# EAGLE design E_LELE (EAGLE 9.5.1)
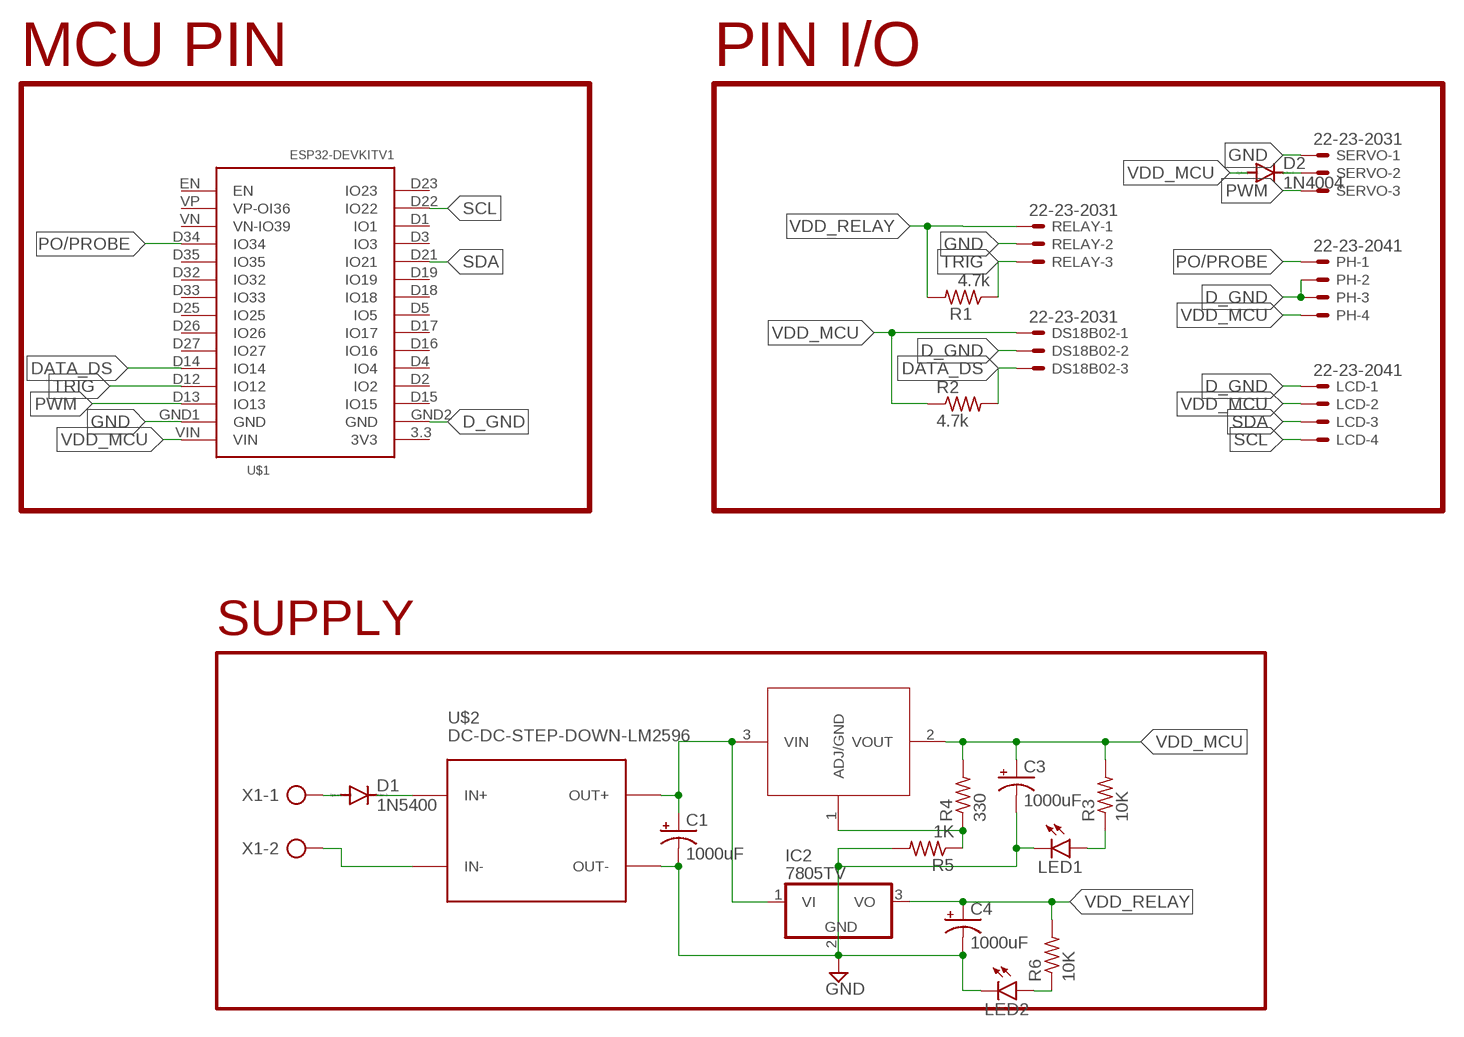
[diagram p0: schematic, sheet 1]

## Parts
C1  1000uF  CPOL-USE5-10.5  [E5-10,5]
C3  1000uF  CPOL-USE5-10.5  [E5-10,5]
C4  1000uF  CPOL-USE5-10.5  [E5-10,5]
D1  1N5400  [DO201-15]
D2  1N4004  [DO41-10]
DS18B02  22-23-2031  [22-23-2031]
IC2  7805TV  [TO220V]
LCD  22-23-2041  [22-23-2041]
LED1  LED3MM  [LED3MM]
LED2  LED3MM  [LED3MM]
LM338T  LM1084IT-5.0  [T03B_TEX]
PH  22-23-2041  [22-23-2041]
R1  4.7k  R-US_0204/7  [0204/7]
R2  4.7k  R-US_0204/7  [0204/7]
R3  10K  R-US_0204/7  [0204/7]
R4  330  R-US_0204/7  [0204/7]
R5  1K  R-US_0204/7  [0204/7]
R6  10K  R-US_0204/7  [0204/7]
RELAY  22-23-2031  [22-23-2031]
SERVO  22-23-2031  [22-23-2031]
U$1  ESP32DEVKITV1  [ESP32-DEVKITV1]
U$2  DC-DC-STEP-DOWN-LM2596  [DC-DC-STEP-DOWN-LM2596]
X1  AK500/2  [AK500/2]

## Nets
ADJ: LM338T.1(ADJ/GND) R4.1 R5.1
D_GND: DS18B02.2 LCD.1 PH.2 PH.3 U$1.GND2(GND)
DATA_DS: DS18B02.3 R2.2 U$1.D14(IO14)
GND: C1.- C3.- C4.- IC2.2(GND) LED1.K(C) LED2.K(C) R5.2 RELAY.2 SERVO.1 U$1.GND1(GND) U$2.OUT-
N$1: D1.A X1.1
N$2: D1.C U$2.IN+
N$3: U$2.IN- X1.2
N$4: LED1.A R3.1
N$7: LED2.A R6.1
OUT+: C1.+ IC2.1(VI) LM338T.3(VIN) U$2.OUT+
PO/PROBE: PH.1 U$1.D34(IO34)
PWM: SERVO.3 U$1.D13(IO13)
SCL: LCD.4 U$1.D22(IO22)
SDA: LCD.3 U$1.D21(IO21)
TRIG: R1.1 RELAY.3 U$1.D12(IO12)
V_SERVO: D2.C SERVO.2
VDD_MCU: C3.+ D2.A DS18B02.1 LCD.2 LM338T.2(VOUT) PH.4 R2.1 R3.2 R4.2 U$1.VIN
VDD_RELAY: C4.+ IC2.3(VO) R1.2 R6.2 RELAY.1
Unconnected: U$1.3.3(3V3) U$1.D1(IO1) U$1.D2(IO2) U$1.D3(IO3) U$1.D4(IO4) U$1.D5(IO5) U$1.D15(IO15) U$1.D16(IO16) U$1.D17(IO17) U$1.D18(IO18) U$1.D19(IO19) U$1.D23(IO23) U$1.D25(IO25) U$1.D26(IO26) U$1.D27(IO27) U$1.D32(IO32) U$1.D33(IO33) U$1.D35(IO35) U$1.EN U$1.VN(VN-IO39) U$1.VP(VP-OI36)

## Notes on the sheet
- MCU PIN | PIN I/O
- SUPPLY

## Library data of the parts
C1 C3 C4 = rcl:CPOL-US: POLARIZED CAPACITOR, American symbol; SPICEPREFIX: C
D1 = diode:1N5400: DIODE standard rectifier, 3 A, 50 V (Motorola)
D2 = diode:1N4004: DIODE general purpose rectifier, 1 A
DS18B02 RELAY SERVO = con-molex:22-23-2031: .100" (2.54mm) Center Header - 3 Pin; MF: MOLEX; MPN: 22-23-2031; OC_FARNELL: 1462950; OC_NEWARK: 30C0862
IC2 = linear:78*: Positive VOLTAGE REGULATOR Source: http://cache.national.com/ds/LM/LM78L05.pdf http://www.fairchildsemi.com/ds/LM/LM7805.pdf
LCD PH = con-molex:22-23-2041: .100" (2.54mm) Center Header - 4 Pin; MF: MOLEX; MPN: 22-23-2041; OC_FARNELL: 1462920; OC_NEWARK: 38C0355
LED1 LED2 = led:LED: LED OSRAM: - CHIPLED LG R971, LG N971, LY N971, LG Q971, LY Q971, LO R971, LY R971 LH N974, LH R974 LS Q976, LO Q976, LY Q976 LO Q996 - Hyper CHIPLED LW Q18S LB Q993, LB Q99A, LB R99A - SideLED LS A670, LO A670, LY A670, LG A670, LP A670 LB A673, LV A673, LT A673, LW A673 LH A674 LY A675 LS A676, LA A676, LO A676, LY A676, LW A676 LS A679, LY A679, LG A679 - Hyper Micro SIDELED® LS Y876, LA Y876, LO Y876, LY Y876 LT Y87S - SmartLED LW L88C, LW L88S LB L89C, LB L89S, LG L890 LS L89K, LO L89K, LY L89K LS L896, LA L896, LO L896, LY L896 - TOPLED LS T670, LO T670, LY T670, LG T670, LP T670 LSG T670, LSP T670, LSY T670, LOP T670, LYG T670 LG T671, LOG T671, LSG T671 LB T673, LV T673, LT T673, LW T673 LH T674 LS T676, LA T676, LO T676, LY T676, LB T676, LH T676, LSB T676, LW T676 LB T67C, LV T67C, LT T67C, LS T67K, LO T67K, LY T67K, LW E67C LS E67B, LA E67B, LO E67B, LY E67B, LB E67C, LV E67C, LT E67C LW T67C LS T679, LY T679, LG T679 LS T770, LO T770, LY T770, LG T770, LP T770 LB T773, LV T773, LT T773, LW T773 LH T774 LS E675, LA E675, LY E675, LS T675 LS T776, LA T776, LO T776, LY T776, LB T776 LHGB T686 LT T68C, LB T68C - Hyper Mini TOPLED® LB M676 - Mini TOPLED Santana® LG M470 LS M47K, LO M47K, LY M47K Source: http://www.osram.convergy.de LUXEON: - LUMILED® LXK2-PW12-R00, LXK2-PW12-S00, LXK2-PW14-U00, LXK2-PW14-V00 LXK2-PM12-R00, LXK2-PM12-S00, LXK2-PM14-U00 LXK2-PE12-Q00, LXK2-PE12-R00, LXK2-PE12-S00, LXK2-PE14-T00, LXK2-PE14-U00 LXK2-PB12-K00, LXK2-PB12-L00, LXK2-PB12-M00, LXK2-PB14-N00, LXK2-PB14-P00, LXK2-PB14-Q00 LXK2-PR12-L00, LXK2-PR12-M00, LXK2-PR14-Q00, LXK2-PR14-R00 LXK2-PD12-Q00, LXK2-PD12-R00, LXK2-PD12-S00 LXK2-PH12-R00, LXK2-PH12-S00 LXK2-PL12-P00, LXK2-PL12-Q00, LXK2-PL12-R00 Source: www.luxeon.com KINGBRIGHT: KA-3528ASYC Source: www.kingbright.com
LM338T = LM1084IT-5.0:LM1084IT-5.0; BUILT_BY: EMA_UL_Team; COPYRIGHT: Copyright (C) 2018 Accelerated Designs. All rights reserved; MANUFACTURER_PART_NUMBER: LM1084IT-5.0; SOURCELIBRARY: National_2011-01-01_LDO; VENDOR: Texas Instruments
R1-R6 = rcl:R-US_: RESISTOR, American symbol; SPICEPREFIX: R
U$1 = ESP32-DEVKITV1:ESP32DEVKITV1
U$2 = RS485V2:DC-DC-STEP-DOWN-LM2596: DC/DC Step-Down Regulator based on LM2596-ADJ chip LM2596 datasheet available here: http://www.ti.com/lit/ds/symlink/lm2596.pdf Click here to find device on ebay.com <http://www.ebay.com/sch/lm2596+power+regulator>
X1 = con-ptr500:AK500/2: CONNECTOR; OC_FARNELL: unknown; OC_NEWARK: unknown

## Board
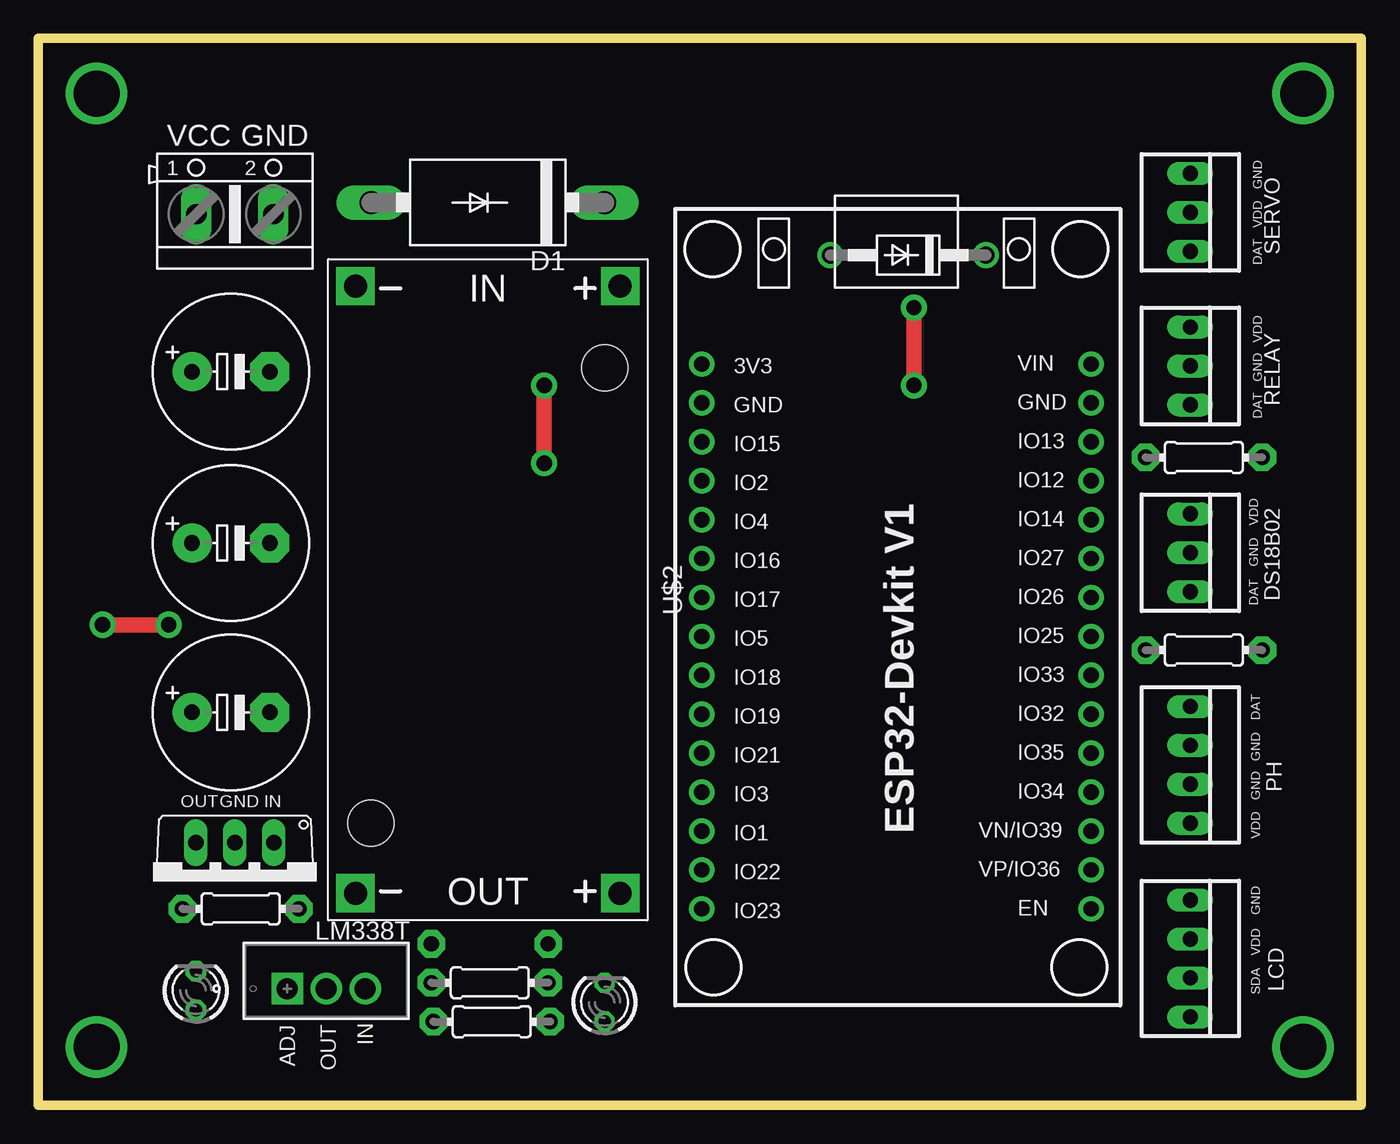
[diagram p1: board, top side]
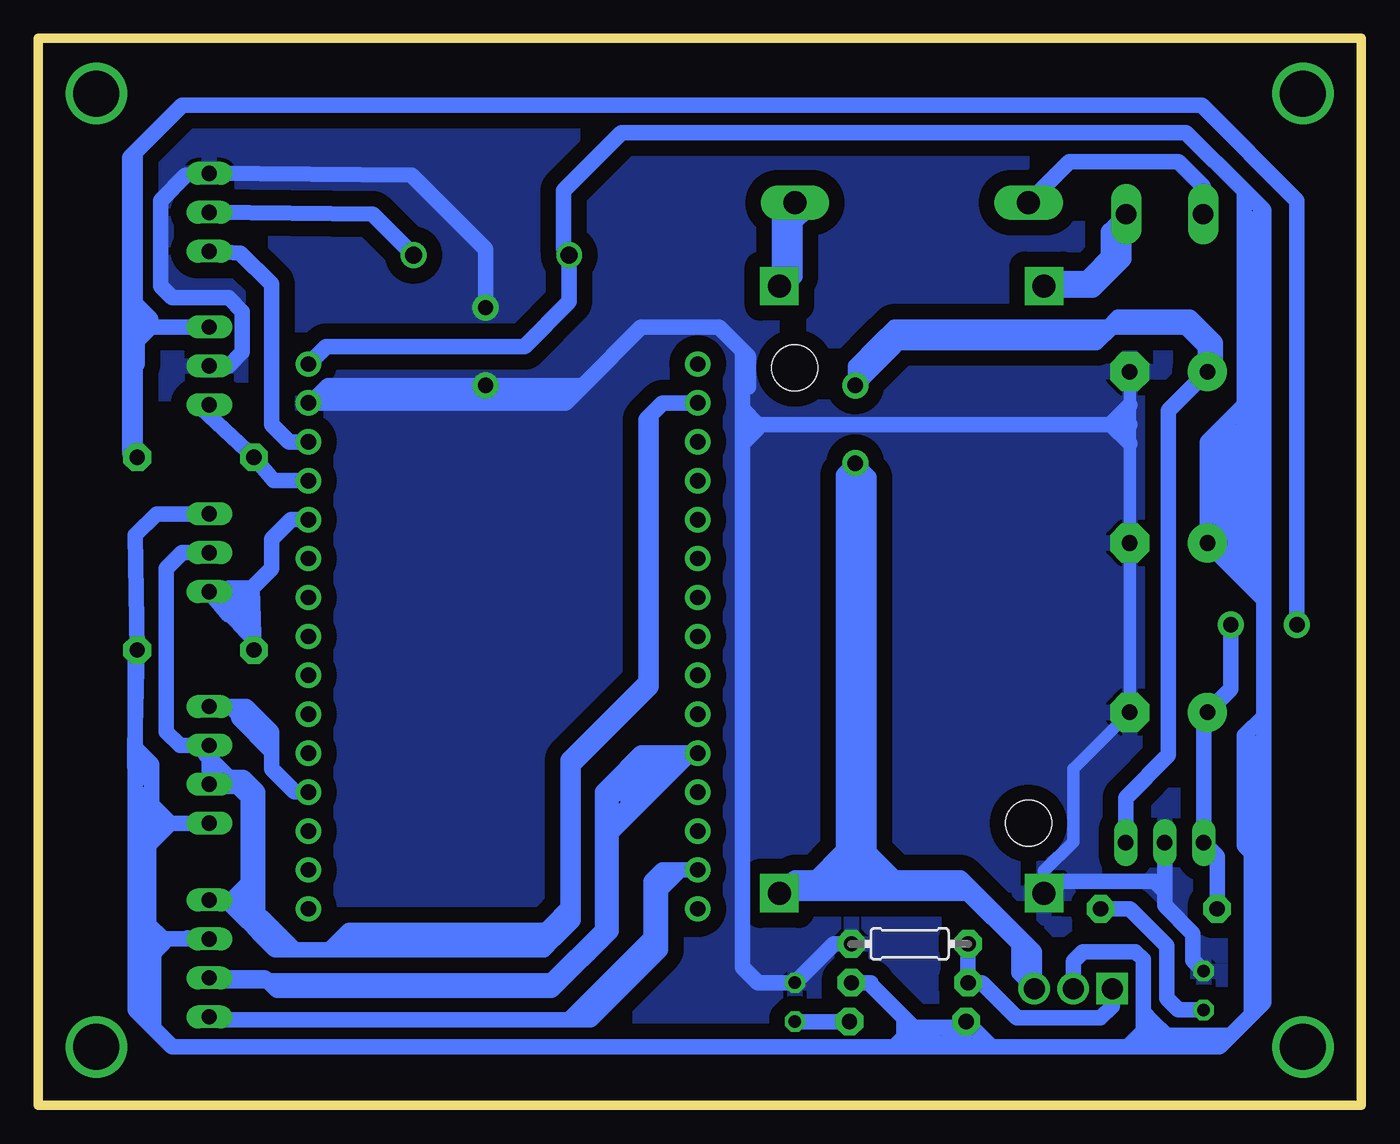
[diagram p2: board, bottom side, seen from below]

Size 86.34 x 69.65 mm. Coordinates in mm from the lower left corner, seen from the top.
Outline: 0,0 86.34,0 86.34,69.65 0,69.65 0,0
Copper layers (1*16): Top 0.035mm / dielectric 1.5mm / Bottom 0.035mm
Design rules "default": minimum track width 6mil, minimum drill 0.35mm, track to track 6mil, track to pad 6mil, pad to pad 6mil, via to via 6mil, smd to smd 6mil, copper to edge 40mil, drill to drill 6mil, minimum pad ring 10mil, minimum via ring 8mil, stop-mask expansion 4mil, vias tented up to drill 0mil, thermal gap 10mil

### Footprints (pad centres in the part's own frame; a part is rotated, then mirrored left to right if it is on the bottom)
E5-10,5 = drill 1.016 pad 2.54: + -2.54,0 | drill 1.016 pad 2.54 octagon: - 2.54,0
DO201-15 = drill 1.499 long: A 7.62,0; C -7.62,0
DO41-10 = drill 1.118: A 5.08,0; C -5.08,0
22-23-2031 = drill 1 long: 1 -2.54,0; 2 0,0; 3 2.54,0
TO220V = drill 1.016 long: 1 -2.54,-2.54; 2 0,-2.54; 3 2.54,-2.54
22-23-2041 = drill 1 long: 1 -3.81,0; 2 -1.27,0; 3 1.27,0; 4 3.81,0
LED3MM = drill 0.813 octagon: A -1.27,0; K 1.27,0
T03B_TEX = drill 1.372 pad 1.88 square: 1 0,0 | drill 1.372 pad 1.88: 2 2.54,0; 3 5.08,0
0204/7 = drill 1 pad 1.8 octagon: 1 -3.81,0; 2 3.81,0
ESP32-DEVKITV1 = drill 1 pad 1.65: 3.3 -16.51,-12.7; D1 13.97,-12.7; D2 -8.89,-12.7; D3 11.43,-12.7; D4 -6.35,-12.7; D5 1.27,-12.7; D12 -8.89,12.7; D13 -11.43,12.7; D14 -6.35,12.7; D15 -11.43,-12.7; D16 -3.81,-12.7; D17 -1.27,-12.7; D18 3.81,-12.7; D19 6.35,-12.7; D21 8.89,-12.7; D22 16.51,-12.7; D23 19.05,-12.7; D25 1.27,12.7; D26 -1.27,12.7; D27 -3.81,12.7; D32 6.35,12.7; D33 3.81,12.7; D34 11.43,12.7; D35 8.89,12.7; EN 19.05,12.7; GND1 -13.97,12.7; GND2 -13.97,-12.7; VIN -16.51,12.7; VN 13.97,12.7; VP 16.51,12.7
DC-DC-STEP-DOWN-LM2596 = drill 1.5 pad 2.5 square: IN+ -19.812,8.636; IN- -19.812,-8.636; OUT+ 19.812,8.636; OUT- 19.812,-8.636 | hole 3: -14.478,7.62; 15.24,-7.62
AK500/2 = drill 1.321 long: 1 -2.515,0; 2 2.515,0

### Placement (x,y rotation side)
C1  12.57,47.88 0 top
C3  12.57,36.7 0 top
C4  12.57,25.65 0 top
D1  29.34,58.93 180 top
D2  56.77,55.5 180 top
DS18B02  75.18,36.07 270 top
IC2  12.83,14.61 180 top
LCD  75.18,9.59 270 top
LED1  36.96,6.73 90 top
LED2  10.29,7.49 90 top
LM338T  16.26,7.62 0 top
PH  75.18,22.22 270 top
R1  76.07,42.29 0 top
R2  76.07,29.72 180 top
R3  29.59,5.46 180 top
R4  29.46,8 0 top
R5  29.46,10.54 180 bottom
R6  13.21,12.83 180 top
RELAY  75.18,48.26 270 top
SERVO  75.18,58.29 270 top
U$1  56.01,31.88 270 top
U$2  29.34,33.66 270 top
X1  12.83,58.17 0 top

### Tracks (layer width: path | path; a pad name or v marks a point on that pad's centre or on a via)
ADJ
  Bottom 1.016: LM338T.1 16.26,6.48 17.02,5.72 22.48,5.72 24.76,8 R4.1 R5.1
D_GND
  Bottom 1.016: DS18B02.2 76.96,36.07 77.98,35.05 77.98,24.38 77.09,23.49 PH.2 | PH.3 PH.2 | PH.3 74.99,21.4 73.91,21.4 | 73.91,21.4 73.09,21.4 | 72.01,11.3 70.87,10.16 69.6,10.16 | 72.64,11.94 72.01,11.3 | 52.7,10.79 51.44,12.06 51.44,12.7 | 52.7,10.79 53.34,10.16 67.31,10.16 | 51.44,22.22 51.44,13.21 | 67.31,10.16 69.6,10.16 | 46.36,45.09 46.36,27.94 | 46.36,27.94 46.36,27.3 51.44,22.22 | 73.03,20.83 72.64,20.83 72.64,20.95 73.09,21.4 | 72.01,11.3 72.01,12.32 | 72.01,12.32 72.01,14.48 | 72.01,14.48 72.01,20.45 72.96,21.4 73.09,21.4 | 69.6,10.16 71.76,12.32 72.01,12.32 | U$1.GND2 45.59,45.85 46.36,45.09 | 67.31,10.16 66.67,10.79 | 66.67,10.79 66.04,11.43 53.34,11.43 | 66.67,10.79 53.34,10.79 | 53.34,10.79 52.7,10.79 | 52.7,10.79 53.02,11.11 | 53.02,11.11 53.34,11.43 | 53.34,10.79 53.02,11.11 | 53.02,11.11 51.75,12.38 | 51.75,12.38 51.44,12.7 | 51.44,12.7 51.44,13.21 | 53.34,11.43 53.21,11.43 51.44,13.21 | 51.75,12.38 51.75,21.91 | 51.75,21.91 51.44,22.22 | 46.36,27.94 46.67,27.62 | 46.67,27.62 51.75,22.54 51.75,21.91 | 46.67,27.62 46.67,44.77 46.36,45.09 | 72.64,14.48 72.64,13.33 | 72.64,13.33 72.64,11.94 | 72.01,14.48 72.14,14.61 | LCD.1 72.77,13.46 72.64,13.33 | 73.91,21.4 75.44,22.92 PH.2 | PH.3 75.31,20.83 73.03,20.83 | 73.03,20.83 72.64,20.45 72.64,20.13 | 72.64,14.48 72.64,20.13 | 72.64,20.13 73.91,21.4 | LCD.1 73.72,13.4 72.64,14.48 | LCD.1 74.1,13.4 72.64,11.94
DATA_DS
  Bottom 1.016: DS18B02.3 73.91,32 73.91,32.26 | 73.91,32.26 73.28,31.62 | 73.28,31.62 72.39,30.73 R2.2 | U$1.D14 69.85,38.23 71.12,36.96 71.12,35.05 72.39,33.78 | 72.39,33.78 72.64,33.78 | 72.64,33.78 73.91,33.78 73.91,32.26 | 73.79,33.53 DS18B02.3 | R2.2 72.39,33.78 | 73.28,31.62 73.28,33.15 72.64,33.78 | DS18B02.3 72.39,30.48 R2.2
GND  (via drill 1 pad 1.7)
  Top 1.016: v57.15,52.07 v57.15,46.99
  Bottom 0.813: C1.- 15.11,45.72 15.11,44.45 15.11,43.18 C3.- C4.- 18.79,21.97 18.79,17.2 20.7,15.3 U$2.OUT- 19.94,13.08 | 12.83,16.26 IC2.2 12.83,15.88
  Bottom 1.016: IC2.2 12.83,13.97 | 12.83,13.97 12.83,13.05 10.97,11.2 10.97,9.45 LED2.K | R5.2 34.42,10.54 LED1.K 39.37,8 40.39,9.02 40.39,43.18 | RELAY.2 73.91,48.26 73.03,49.15 73.03,51.82 73.91,52.71 77.6,52.71 78.36,53.47 78.36,59.05 76.71,60.71 SERVO.1 61.98,60.71 57.15,55.88 v57.15,52.07 | U$1.GND1 68.58,45.85 | 68.58,45.85 66.29,45.85 | 57.15,45.85 58.42,45.85 | 57.15,45.85 56.01,45.85 | 56.01,45.85 52.07,45.85 | 52.07,45.85 51.94,45.85 50.8,46.99 | 50.8,46.99 46.99,50.8 41.91,50.8 40.39,49.28 | 39.98,46.88 39.98,48.87 40.39,49.28 | 15.11,44.45 16.38,44.45 | 16.38,44.45 39.37,44.45 | 12.83,13.97 13.46,14.61 19.94,14.61 U$2.OUT- | 40.39,43.18 40.39,44.45 | 40.39,44.45 40.39,45.47 | 40.39,45.47 40.39,49.28 | v57.15,46.99 57.15,45.85 | v57.15,46.99 56.52,46.36 | 56.52,46.36 56.01,45.85 | v57.15,46.99 50.8,46.99 | 52.07,45.85 52.58,46.36 56.52,46.36 | v57.15,46.99 57.28,46.99 | 57.28,46.99 67.44,46.99 | 67.44,46.99 68.58,45.85 | 58.42,45.85 57.85,46.42 | 57.85,46.42 57.28,46.99 | 58.42,45.85 66.29,45.85 | 66.29,45.85 66.74,46.29 | 66.74,46.29 67.44,46.99 | 57.85,46.42 66.61,46.42 66.74,46.29 | 39.37,44.45 40.39,44.45 | 40.39,45.47 39.37,44.45 | 39.37,44.45 39.37,44.2 40.39,43.18 | 15.11,45.72 16.38,44.45 | 16.38,44.45 15.11,43.18
  pour Bottom (isolate 1.016): 0,69.85 86.36,69.85 86.36,0 0,0
N$1
  Bottom 1.016: D1.A 19.05,61.6 11.94,61.6 10.31,59.97 X1.1
N$2
  Bottom 1.016: U$2.IN+ 37.97,57.91 | 37.47,58.42 37.97,57.91 | 37.47,57.15 37.47,53.59 36.96,54.1 D1.C 37.08,59.05 | 37.47,57.15 37.47,58.42 | 37.47,58.42 37.34,58.55 | 37.08,59.05 37.85,59.05 37.97,58.93 37.97,57.91 | 37.47,57.15 35.69,58.93 35.56,58.93 35.69,59.05 37.08,59.05
N$3
  Bottom 1.016: X1.2 16.13,57.38 16.13,55.75 17.91,53.98 20.32,53.98 20.45,54.1 20.7,53.85 U$2.IN- 20.45,53.21 17.53,53.21 15.49,55.25 15.49,57.15 16.38,57.15 16.51,57.02 16.51,54.61 17.78,53.34 19.05,53.34
N$4
  Bottom 1.016: LED1.A R3.1
N$6  (via drill 3)
  other vias: 3.81,66.04
N$7
  Bottom 1.016: R6.1 15.11,12.83 12.7,10.41 12.7,6.99 11.94,6.22 LED2.A
N$8  (via drill 3)
  other vias: 82.55,66.04
N$9  (via drill 3)
  other vias: 82.55,3.81
N$10  (via drill 3)
  other vias: 3.81,3.81
OUT+  (via drill 1 pad 1.7)
  Top 1.016: v33.02,46.99 v33.02,41.91
  Bottom 1.016: IC2.1 15.37,20.07 12.57,22.86 12.57,45.34 C1.+ | 33.02,13.84 U$2.OUT+ 36.96,14.86 35.56,14.86 | 33.02,13.84 25.65,13.84 | 25.65,13.84 25.15,13.84 | 25.15,13.84 21.34,10.03 LM338T.3 22.35,8.64 22.35,10.54 25.65,13.84 | C1.+ 10.16,48.01 10.16,49.53 11.43,50.8 16.26,50.8 | 16.26,50.8 16.51,50.8 | 16.51,50.8 30.48,50.8 31.5,49.78 | 31.5,49.78 33.02,48.26 v33.02,46.99 30.48,49.53 | v33.02,41.91 33.02,16.51 | 33.02,14.86 33.02,16.51 | 33.02,13.84 33.02,14.86 | 34.67,14.86 33.78,14.86 | 33.78,14.86 33.02,14.86 | 33.02,14.86 31.75,14.86 | 30.48,14.86 26.16,14.86 25.15,13.84 | 30.48,14.86 31.75,14.86 | v33.02,41.91 32.13,41.02 32.13,16.51 | 31.75,14.86 32.13,15.24 32.13,16.51 | v33.02,41.91 33.78,41.15 33.78,14.86 | 32.13,16.51 30.48,14.86 | 33.02,16.51 34.67,14.86 | 34.67,14.86 35.56,14.86 | 33.02,16.51 33.91,16.51 35.56,14.86 | 16.51,50.8 17.14,50.16 30.23,50.16 30.48,49.91 30.48,49.53 | 31.5,49.78 31.24,49.53 30.48,49.53 | 31.5,49.78 17.27,49.78 16.26,50.8 | C1.+ 9.52,48.39 9.52,49.78 11.18,51.44 15.88,51.44 16.51,50.8
PO/PROBE
  Bottom 1.016: U$1.D34 69.6,20.45 71.12,21.97 71.12,23.11 | 71.12,23.11 71.12,23.37 | 71.12,23.37 71.12,24.13 | 71.12,24.38 72.77,26.04 73.79,26.04 | 73.28,25.53 73.28,25.27 71.12,23.11 | 71.12,23.37 73.28,25.53 | 73.28,25.53 73.79,26.04 | PH.1 73.79,26.04
PWM
  Bottom 1.016: SERVO.3 73.15,55.63 71.12,53.59 71.12,44.45 69.98,43.31 U$1.D13
SCL
  Bottom 1.016: 50.8,5.59 50.29,5.59 46.36,9.52 | 50.8,5.59 51.69,5.59 | 44.45,15.37 45.59,15.37 46.36,14.61 46.36,10.92 | 44.45,15.37 U$1.D22 | 46.36,10.16 46.36,10.92 | 46.36,10.16 46.36,9.52 | 44.45,15.37 45.72,14.1 45.72,10.16 46.36,9.52 | 46.36,10.16 50.8,5.72 50.8,5.59 | 46.36,10.92 51.69,5.59 | LCD.4 75.25,5.59 51.69,5.59
SDA
  Bottom 1.016: 44.45,22.99 U$1.D21 43.75,22.99 45.43,21.3 | 44.45,22.99 46.99,22.99 48.96,21.02 | 49.53,11.43 52.83,8.13 67.31,8.13 71.37,8.13 | 49.53,11.43 49.53,20.45 48.96,21.02 | 48.96,21.02 48.96,20.32 | 48.96,20.32 48.96,19.05 | 48.96,19.05 48.96,17.78 | 48.96,17.78 48.96,12 | 48.96,12 49.53,11.43 | 45.43,21.3 48.96,17.78 | 44.45,22.99 45.15,22.29 | 45.15,22.29 47.05,20.38 | 47.05,20.38 48.39,19.05 48.96,19.05 | 45.15,22.29 46.99,22.29 47.34,21.94 | 48.96,20.32 48.26,21.02 | 47.34,21.94 47.34,21.24 47.62,20.95 | 47.62,20.95 48.26,20.32 48.26,21.02 | 48.26,21.02 47.97,21.3 | 47.97,21.3 47.34,21.94 | 47.62,20.95 47.05,20.38 | 45.43,21.3 47.97,21.3 | 48.96,12 48.96,11.37 52.83,7.49 69.85,7.49 70.74,7.49 71.37,8.13 | 71.06,7.81 71.56,8.32 LCD.3 75.25,8.13 71.37,8.13
TRIG
  Bottom 1.016: U$1.D12 70.99,40.77 R1.1 75.69,45.47 RELAY.3
V_SERVO
  Bottom 1.016: SERVO.2 64.52,58.17 D2.C
VDD_MCU
  Bottom 1.016: LM338T.2 18.8,9.4 18.16,10.03 14.73,10.03 14.22,9.52 14.22,6.1 | 12.7,4.57 13.59,5.46 | 13.59,5.46 14.22,6.1 | 12.7,4.57 11.43,4.57 | 11.43,4.57 8.51,4.57 | 8.51,4.57 7.18,5.91 | 6.35,25.4 6.35,33.02 | 6.35,33.02 6.35,34.29 | 6.35,34.54 6.35,34.29 | 6.35,34.54 7.49,35.69 | 7.49,35.69 8.13,36.32 | 8.13,36.32 8.51,36.7 | R4.2 32,8 32,7.87 29.85,5.72 | U$1.VIN 67.56,49.53 54.61,49.53 51.69,52.45 D2.A 52.07,55.88 52.07,59.69 48.26,63.5 11.43,63.5 7.62,59.69 | R2.1 80.05,23.37 | 80.05,23.37 80.01,20.57 79.63,20.19 | 80.01,28.96 80.01,21.08 | 80.01,21.08 80.01,11.43 | 80.01,29.5 R2.1 | 30.48,3.81 77.6,3.81 78.8,5.02 | 30.48,3.81 29.21,3.81 | 29.21,3.81 27.94,3.81 | 27.43,3.81 26.67,3.81 | 26.67,3.81 25.78,4.7 R3.2 | R2.1 80.01,37.21 78.61,38.61 DS18B02.1 | 11.43,4.57 12.19,3.81 | 24.13,3.81 26.67,3.81 | 15.24,3.81 24.13,3.81 | 15.24,3.81 13.97,3.81 | 12.19,3.81 13.97,3.81 | 12.19,3.81 9.27,3.81 8.51,4.57 | 6.35,34.54 6.35,36.83 | 6.35,36.83 6.35,38.1 | 6.35,38.1 6.35,39.37 | 6.35,39.37 6.35,58.42 | 6.35,58.42 7.62,59.69 | C3.+ 8.89,36.7 | 8.89,36.7 8.51,36.7 | 8.51,36.7 6.48,36.7 | 6.48,36.7 6.35,36.83 | 7.49,35.69 6.48,36.7 | 8.51,36.7 8.51,37.21 | 8.51,37.21 7.62,38.1 | 7.62,38.1 6.98,38.73 | 6.98,38.73 6.35,39.37 | 8.13,36.32 6.35,38.1 | 14.22,6.1 14.22,4.06 13.97,3.81 | 13.97,3.81 13.21,4.57 12.7,4.57 | 13.59,5.46 15.24,3.81 | R3.2 24.13,3.81 | 80.01,11.43 80.01,10.16 | 80.01,10.16 80.01,9.02 | 80.01,6.6 80.01,9.02 | 79.63,6.22 80.01,6.6 | R3.2 26.16,5.08 27.94,5.08 | 27.94,5.08 29.21,5.08 | 29.85,5.72 29.21,5.08 | 29.21,5.08 27.94,3.81 | 29.85,4.44 29.21,3.81 | 29.21,5.08 29.85,4.44 | 29.85,5.72 29.85,4.44 | 29.85,4.44 30.48,3.81 | 27.94,3.81 27.43,3.81 | R3.2 27.43,3.81
  Bottom 1.016: 27.43,3.81 27.94,4.32 27.94,5.08 | 7.62,38.1 7.62,45.72 | 7.62,45.72 7.62,59.69 | 6.35,58.42 6.98,57.79 6.98,38.73 | 7.62,45.72 8.89,44.45 | 8.89,44.45 10.03,43.31 10.03,41.91 | 8.51,37.21 8.51,39.37 | 8.51,39.37 8.51,40.64 | 8.51,40.64 8.51,43.18 | 8.51,43.18 8.51,44.07 8.89,44.45 | 8.89,36.83 8.89,36.7 | 10.03,41.91 10.03,40.77 | 10.03,40.77 10.03,39.37 | 10.03,39.37 10.03,37.97 | 10.03,37.97 8.89,36.83 | 8.89,44.45 8.89,41.91 | 8.89,41.91 8.89,39.37 | 8.89,39.37 8.89,36.83 | C3.+ 10.03,37.97 | 8.51,43.18 8.76,43.18 10.03,41.91 | 8.89,41.91 10.03,40.77 | 8.51,40.64 8.76,40.64 10.03,39.37 | 8.51,39.37 9.91,37.97 10.03,37.97 | 8.89,39.37 10.03,39.37 | 6.35,33.02 C3.+ | C3.+ 7.62,34.29 6.48,34.29 | 6.35,34.29 6.48,34.29 | 6.48,34.29 8.89,36.7 | 7.18,5.91 7.18,16.51 | 7.18,16.51 7.18,23.68 7.62,24.13 | 7.62,24.13 6.35,25.4 | 6.35,25.4 6.35,6.73 7.18,5.91 | 7.62,24.13 7.62,16.95 7.18,16.51 | 79.88,11.56 80.01,11.43 | 76.58,10.92 LCD.2 78.17,10.86 | 79.63,5.84 79.63,6.22 | 79.63,6.22 79.63,9.14 | 79.63,9.14 79.63,12.32 | 79.63,12.32 79.63,16.51 | 79.63,16.51 79.63,17.02 | 79.63,17.02 79.63,18.29 | 79.63,18.29 79.63,19.05 | 79.63,19.05 79.63,20.19 | 79.63,18.29 79.5,18.41 78.99,18.41 | PH.4 77.72,18.41 | 78.23,18.41 78.99,18.41 | 77.72,18.41 78.93,19.62 | 78.93,19.62 79.5,20.19 79.63,20.19 | 78.99,18.41 79.63,19.05 | 77.72,18.41 78.23,18.41 | 79.12,17.53 79.63,17.02 | 78.42,10.86 79.31,10.86 80.01,10.16 | 78.17,10.86 79.12,11.81 | 79.12,11.81 79.63,12.32 | 80.01,9.02 78.8,10.48 78.42,10.86 | 78.42,10.86 78.17,10.86 | 78.17,10.86 78.8,10.22 | 78.8,10.22 80.01,9.02 | 77.72,18.41 79.63,16.51 | 29.21,3.81 12.19,3.81 | 79.12,11.81 79.12,17.53 | 79.12,17.53 78.23,18.41
  Bottom 1.016: 78.93,19.62 78.93,22.16 | 80.05,23.37 78.93,22.26 78.93,22.16 | 80.01,21.08 78.93,22.16 | 78.17,10.86 78.17,10.61 79.63,9.14 | 79.63,5.84 78.8,5.02 | 78.8,5.02 78.8,10.22 | 80.01,6.6 80.01,6.22 79.63,5.84
VDD_RELAY  (via drill 1 pad 1.7)
  Top 1.016: v8.51,31.37 v4.19,31.37
  Bottom 1.016: R6.2 9.4,16.26 IC2.3 10.29,25.4 C4.+ 8.51,27.18 v8.51,31.37 | 80.01,48.26 79.88,48.39 79.88,49.15 79.88,49.53 | 80.01,48.26 80.01,42.42 R1.2 80.39,42.55 80.39,61.85 80.01,62.23 | v4.19,31.37 4.19,59.05 10.41,65.28 76.96,65.28 80.01,62.23 | 80.01,48.26 80.01,49.53 | 79.88,49.53 80.01,49.53 | 80.01,49.53 80.01,50.8 | 80.01,50.8 80.01,52.32 | 80.01,52.32 80.01,62.23 | RELAY.1 78.99,50.8 | 80.01,50.8 78.99,50.8 | 78.99,50.8 79.88,49.91 79.88,49.53 | 78.99,50.8 78.99,51.31 80.01,52.32

### Text on the board
tNames: VCC | GND | GND | VDD | DAT | VDD | GND | DAT | VDD | GND | DAT | DAT | GND | GND | OUT | GND | IN | VDD | GND | VDD | SDA | IN | ADJ | OUT